# Altium schematic sheet Glue.SchDoc
size A3; SheetNumber: 3; SheetTotal: 3
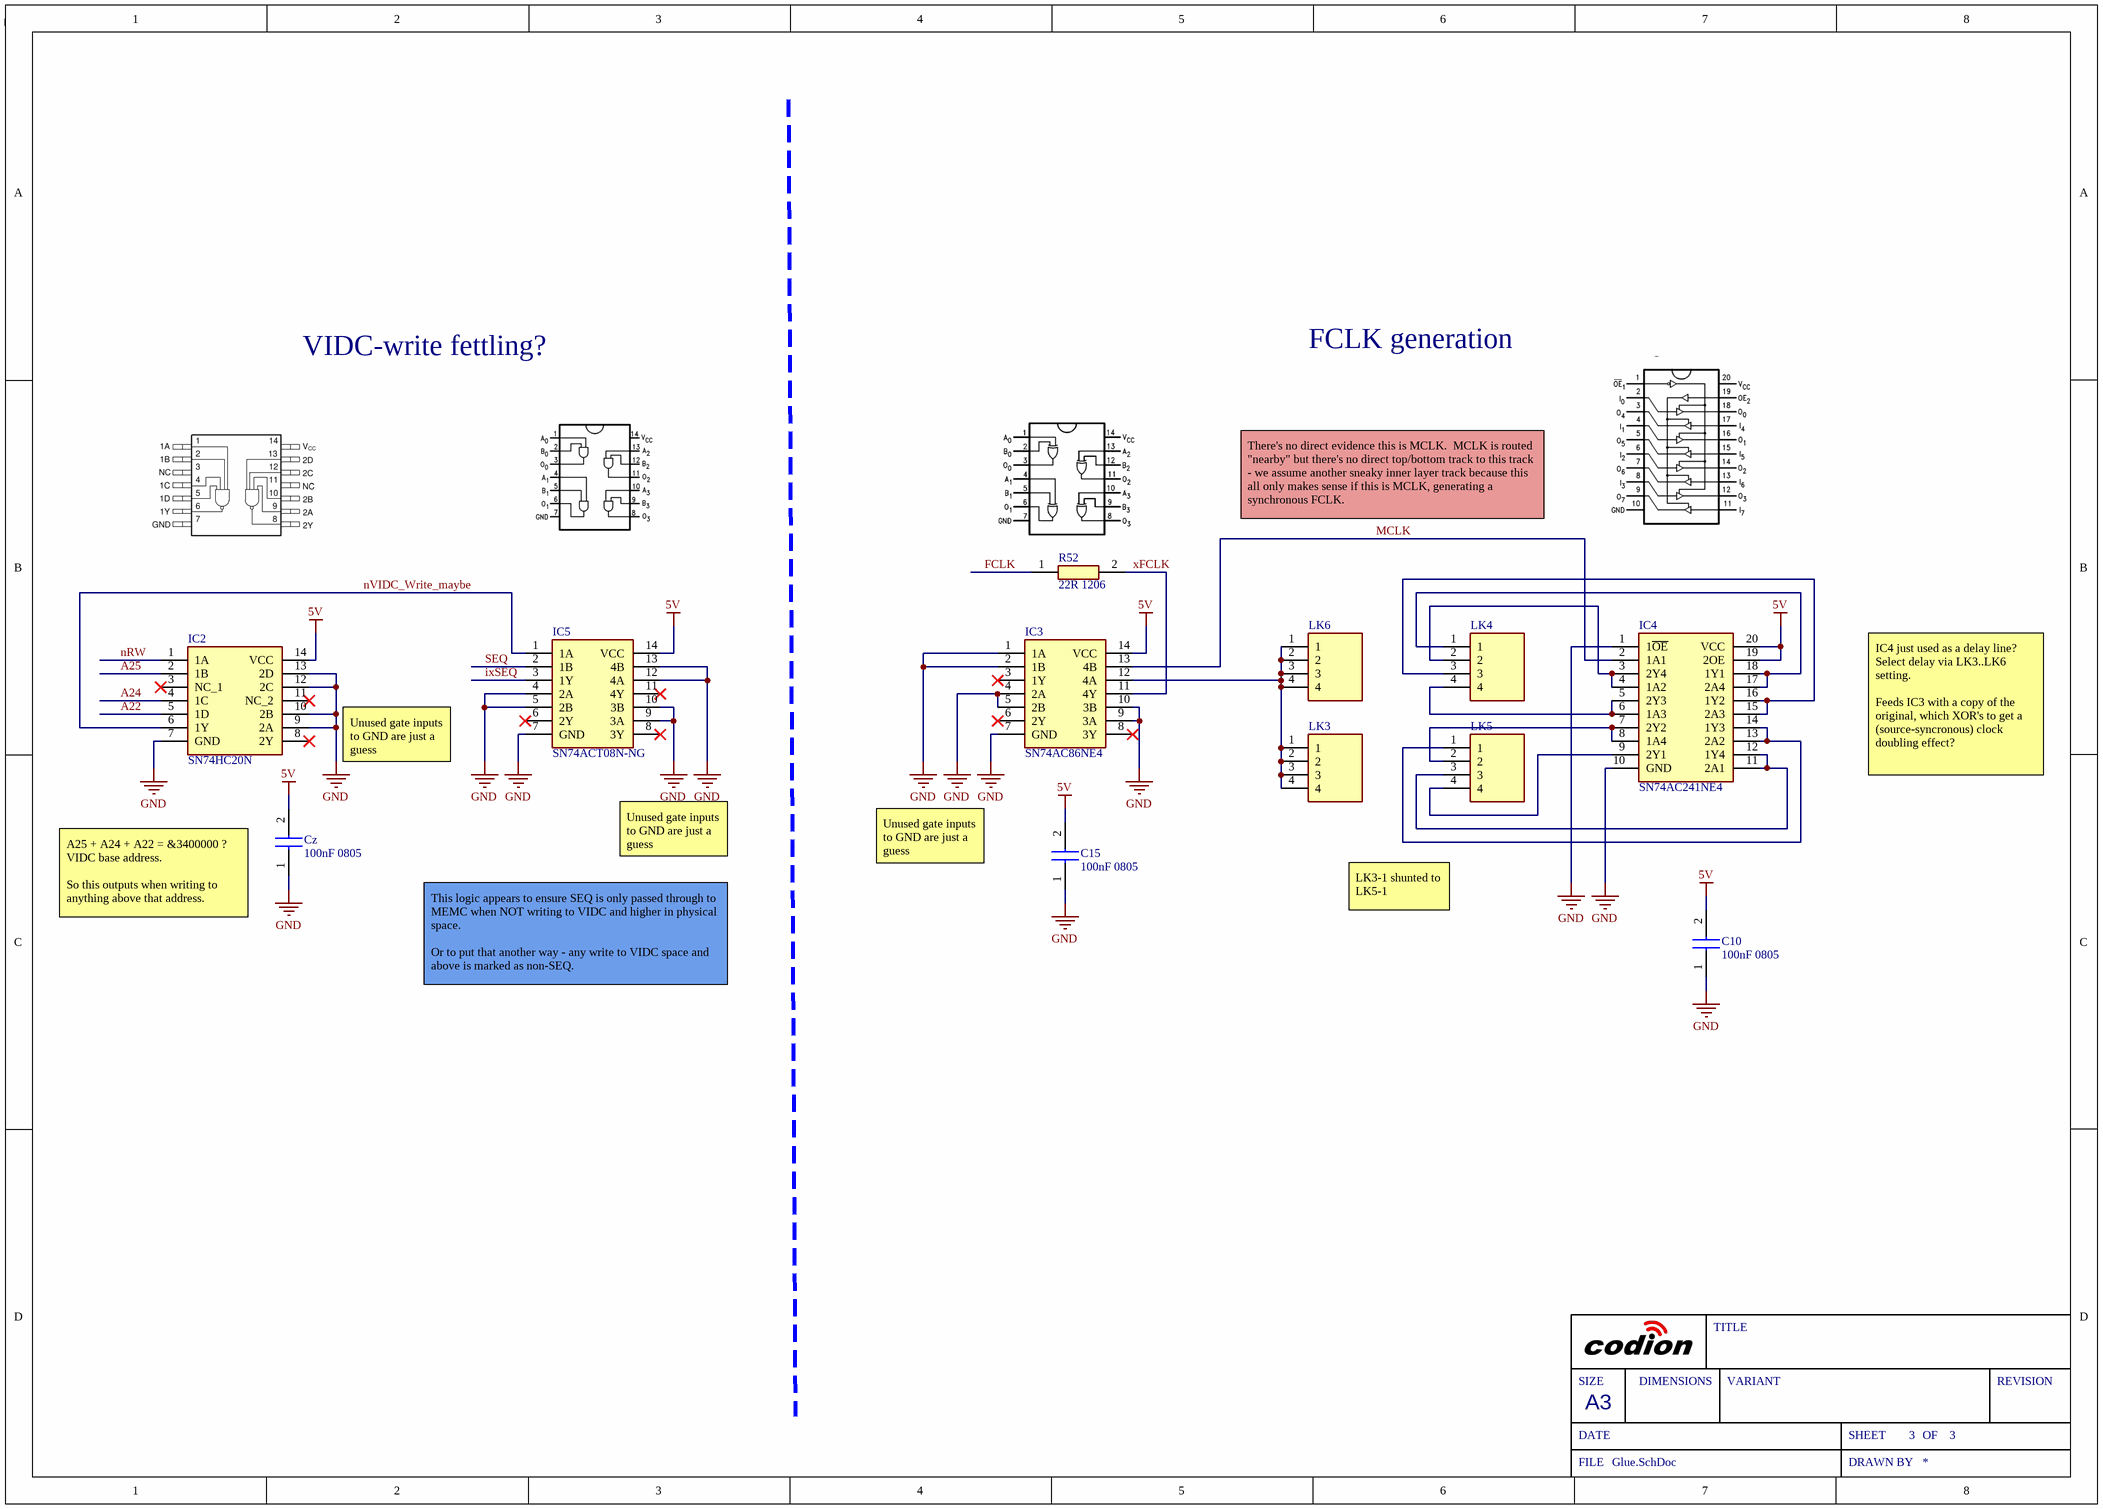
[diagram p0: Glue.SchDoc]

## Parts
C10  100nF 0805  [CAPC2012X140N]
C15  100nF 0805  [CAPC2012X140N]
Cz  100nF 0805  [CAPC2012X140N]
IC2  SN74HC20N  [DIP794W53P254L1930H508Q14N]
IC3  SN74AC86NE4  [DIP794W53P254L1930H508Q14N]
IC4  SN74AC241NE4  [DIP794W53P254L2540H508Q20N]
IC5  SN74ACT08N-NG  [DIP794W53P254L1930H508Q14N]
LK3  PREC004SAAN-RC  [HDRV4W64P0X254_1X4_1016X254X854P]  (value not drawn)
LK4  PREC004SAAN-RC  [HDRV4W64P0X254_1X4_1016X254X854P]  (value not drawn)
LK5  PREC004SAAN-RC  [HDRV4W64P0X254_1X4_1016X254X854P]  (value not drawn)
LK6  PREC004SAAN-RC  [HDRV4W64P0X254_1X4_1016X254X854P]  (value not drawn)
R52  22R 1206  [ERJUP8]

## Nets
5V: C10.2 C15.2 Cz.2 IC2.14(VCC) IC3.14(VCC) IC4.19(2OE) IC4.20(VCC) IC5.14(VCC)
GND: C10.1 C15.1 Cz.1 IC2.7(GND) IC2.9(2A) IC2.10(2B) IC2.12(2C) IC2.13(2D) IC3.1(1A) IC3.2(1B) IC3.4(2A) IC3.5(2B) IC3.7(GND) IC3.9(3A) IC3.10(3B) IC4.1(1~{OE}) IC4.10(GND) IC5.4(2A) IC5.5(2B) IC5.7(GND) IC5.9(3A) IC5.10(3B) IC5.12(4A) IC5.13(4B)
A22: IC2.5(1D)
A24: IC2.4(1C)
A25: IC2.2(1B)
FCLK: R52.1
ixSEQ: IC5.3(1Y)
MCLK: IC3.13(4B) IC4.2(1A1)
nRW: IC2.1(1A)
nVIDC_Write_maybe: IC2.6(1Y) IC5.1(1A)
SEQ: IC5.2(1B)
xFCLK: IC3.11(4Y) R52.2
NetIC3_12: IC3.12(4A) LK3.1 LK3.2 LK3.3 LK3.4 LK6.1 LK6.2 LK6.3 LK6.4
NetIC4_3: IC4.3(2Y4) IC4.4(1A2) LK4.2
NetIC4_5: IC4.5(2Y3) IC4.6(1A3) LK4.4
NetIC4_7: IC4.7(2Y2) IC4.8(1A4) LK5.2
NetIC4_9: IC4.9(2Y1) LK5.4
NetIC4_11: IC4.11(2A1) IC4.12(1Y4) LK5.3
NetIC4_13: IC4.13(2A2) IC4.14(1Y3) LK5.1
NetIC4_15: IC4.15(2A3) IC4.16(1Y2) LK4.3
NetIC4_17: IC4.17(2A4) IC4.18(1Y1) LK4.1

Not connected (* = marked no-connect by the designer): IC2 3(NC_1)* 8(2Y)* 11(NC_2)*; IC3 3(1Y)* 6(2Y)* 8(3Y)*; IC5 6(2Y)* 8(3Y)* 11(4Y)*

## Notes on the sheet
- VIDC-write fettling?
- FCLK generation
- There's no direct evidence this is MCLK.  MCLK is routed "nearby" but there's no direct top/bottom track to this track - we assume another sneaky inner layer track because this all only makes sense if this is MCLK, generating a synchronous FCLK.
- Unused gate inputs to GND are just a guess
- IC4 just used as a delay line?   Select delay via LK3..LK6 setting.
  Feeds IC3 with a copy of the original, which XOR's to get a (source-syncronous) clock doubling effect?
- (near Cz) A25 + A24 + A22 = &3400000 ?  VIDC base address.
  So this outputs when writing to anything above that address.
- LK3-1 shunted to LK5-1
- This logic appears to ensure SEQ is only passed through to MEMC when NOT writing to VIDC and higher in physical space.
  Or to put that another way - any write to VIDC space and above is marked as non-SEQ.
- SIZE
- DIMENSIONS
- TITLE
- VARIANT
- REVISION
- DATE
- A3
- SHEET
- OF
- FILE
- DRAWN BY

## Library data of the parts
C10 C15 Cz = C0805C104J4JACAUTO: Capacitor; Manufacturer_Name: KEMET; Datasheet Link: https://content.kemet.com/datasheets/KEM_C1091_C0G_ESD.pdf; Height: 1.4mm; Manufacturer_Part_Number: C0805C104J4JACAUTO; Mouser Part Number: 80-C0805C104J4JAUTO; Mouser Price/Stock: https://www.mouser.co.uk/ProductDetail/KEMET/C0805C104J4JACAUTO?qs=MyNHzdoqoQKNICuQqAIXfA%3D%3D; Arrow Part Number: C0805C104J4JACAUTO; Arrow Price/Stock: https://www.arrow.com/en/products/c0805c104j4jacauto/kemet-corporation?region=nac
IC2 = SN74HC20N: Integrated Circuit; Manufacturer_Name: Texas Instruments; Datasheet Link: http://www.ti.com/lit/gpn/sn74hc20; Height: 5.08mm; Manufacturer_Part_Number: SN74HC20N; Mouser Part Number: 595-SN74HC20N; Mouser Price/Stock: https://www.mouser.co.uk/ProductDetail/Texas-Instruments/SN74HC20N?qs=pt%2FIv5r0EPf8TTavFR1q%252Bw%3D%3D; Arrow Part Number: SN74HC20N; Arrow Price/Stock: https://www.arrow.com/en/products/sn74hc20n/texas-instruments
IC3 = SN74AC86NE4: Integrated Circuit; Manufacturer_Name: Texas Instruments; Datasheet Link: https://www.ti.com/lit/ds/symlink/sn74ac86.pdf?HQS=dis-dk-null-digikeymode-dsf-pf-null-wwe&ts=1642844260121&ref_url=https%253A%252F%252Fwww.ti.com%252Fgeneral%252Fdocs%252Fsuppproductinfo.tsp%253FdistId%253D10%2526gotoUrl%253Dhttps%253A%252F%252Fwww.ti.co; Height: 5.08mm; Manufacturer_Part_Number: SN74AC86NE4
IC4 = SN74AC241NE4: Integrated Circuit; Manufacturer_Name: Texas Instruments; Datasheet Link: https://www.ti.com/lit/ds/scas513e/scas513e.pdf; Height: 5.08mm; Manufacturer_Part_Number: SN74AC241NE4; Arrow Part Number: SN74AC241NE4; Arrow Price/Stock: https://www.arrow.com/en/products/sn74ac241ne4/texas-instruments
IC5 = SN74ACT08N-NG: Integrated Circuit; Manufacturer_Name: Texas Instruments; Datasheet Link: https://www.ti.com/lit/ds/symlink/sn74act08.pdf?HQS=dis-mous-null-mousermode-dsf-pf-null-wwe&ts=1653633689080&ref_url=https%253A%252F%252Fwww.mouser.in%252F; Height: 5.08mm; Manufacturer_Part_Number: SN74ACT08N-NG
LK3-LK6 = PREC004SAAN-RC: Connector; Manufacturer_Name: Sullins; Datasheet Link: https://drawings-pdf.s3.amazonaws.com/11635.pdf; Height: 8.54mm; Manufacturer_Part_Number: PREC004SAAN-RC
R52 = ERJ-UP8D22R0V: Resistor; Manufacturer_Name: Panasonic; Datasheet Link: https://industrial.panasonic.com/cdbs/www-data/pdf/RDP0000/AOA0000C337.pdf; Height: 0.7mm; Manufacturer_Part_Number: ERJ-UP8D22R0V